# EAGLE design Steuerungsmodul (EAGLE 9.6.2)
BRD_SHEET_NAME: Schaltplan; PROJEKT_NAME: Verstärker_Innovativwoche; REVISION: 1.0; SCH_SHEET_NAME: Steuerungsmodul Verstärker; USER_NAME: Melcher-Millner/Scheffknecht

## Sheet 1 of 2: Input Switch
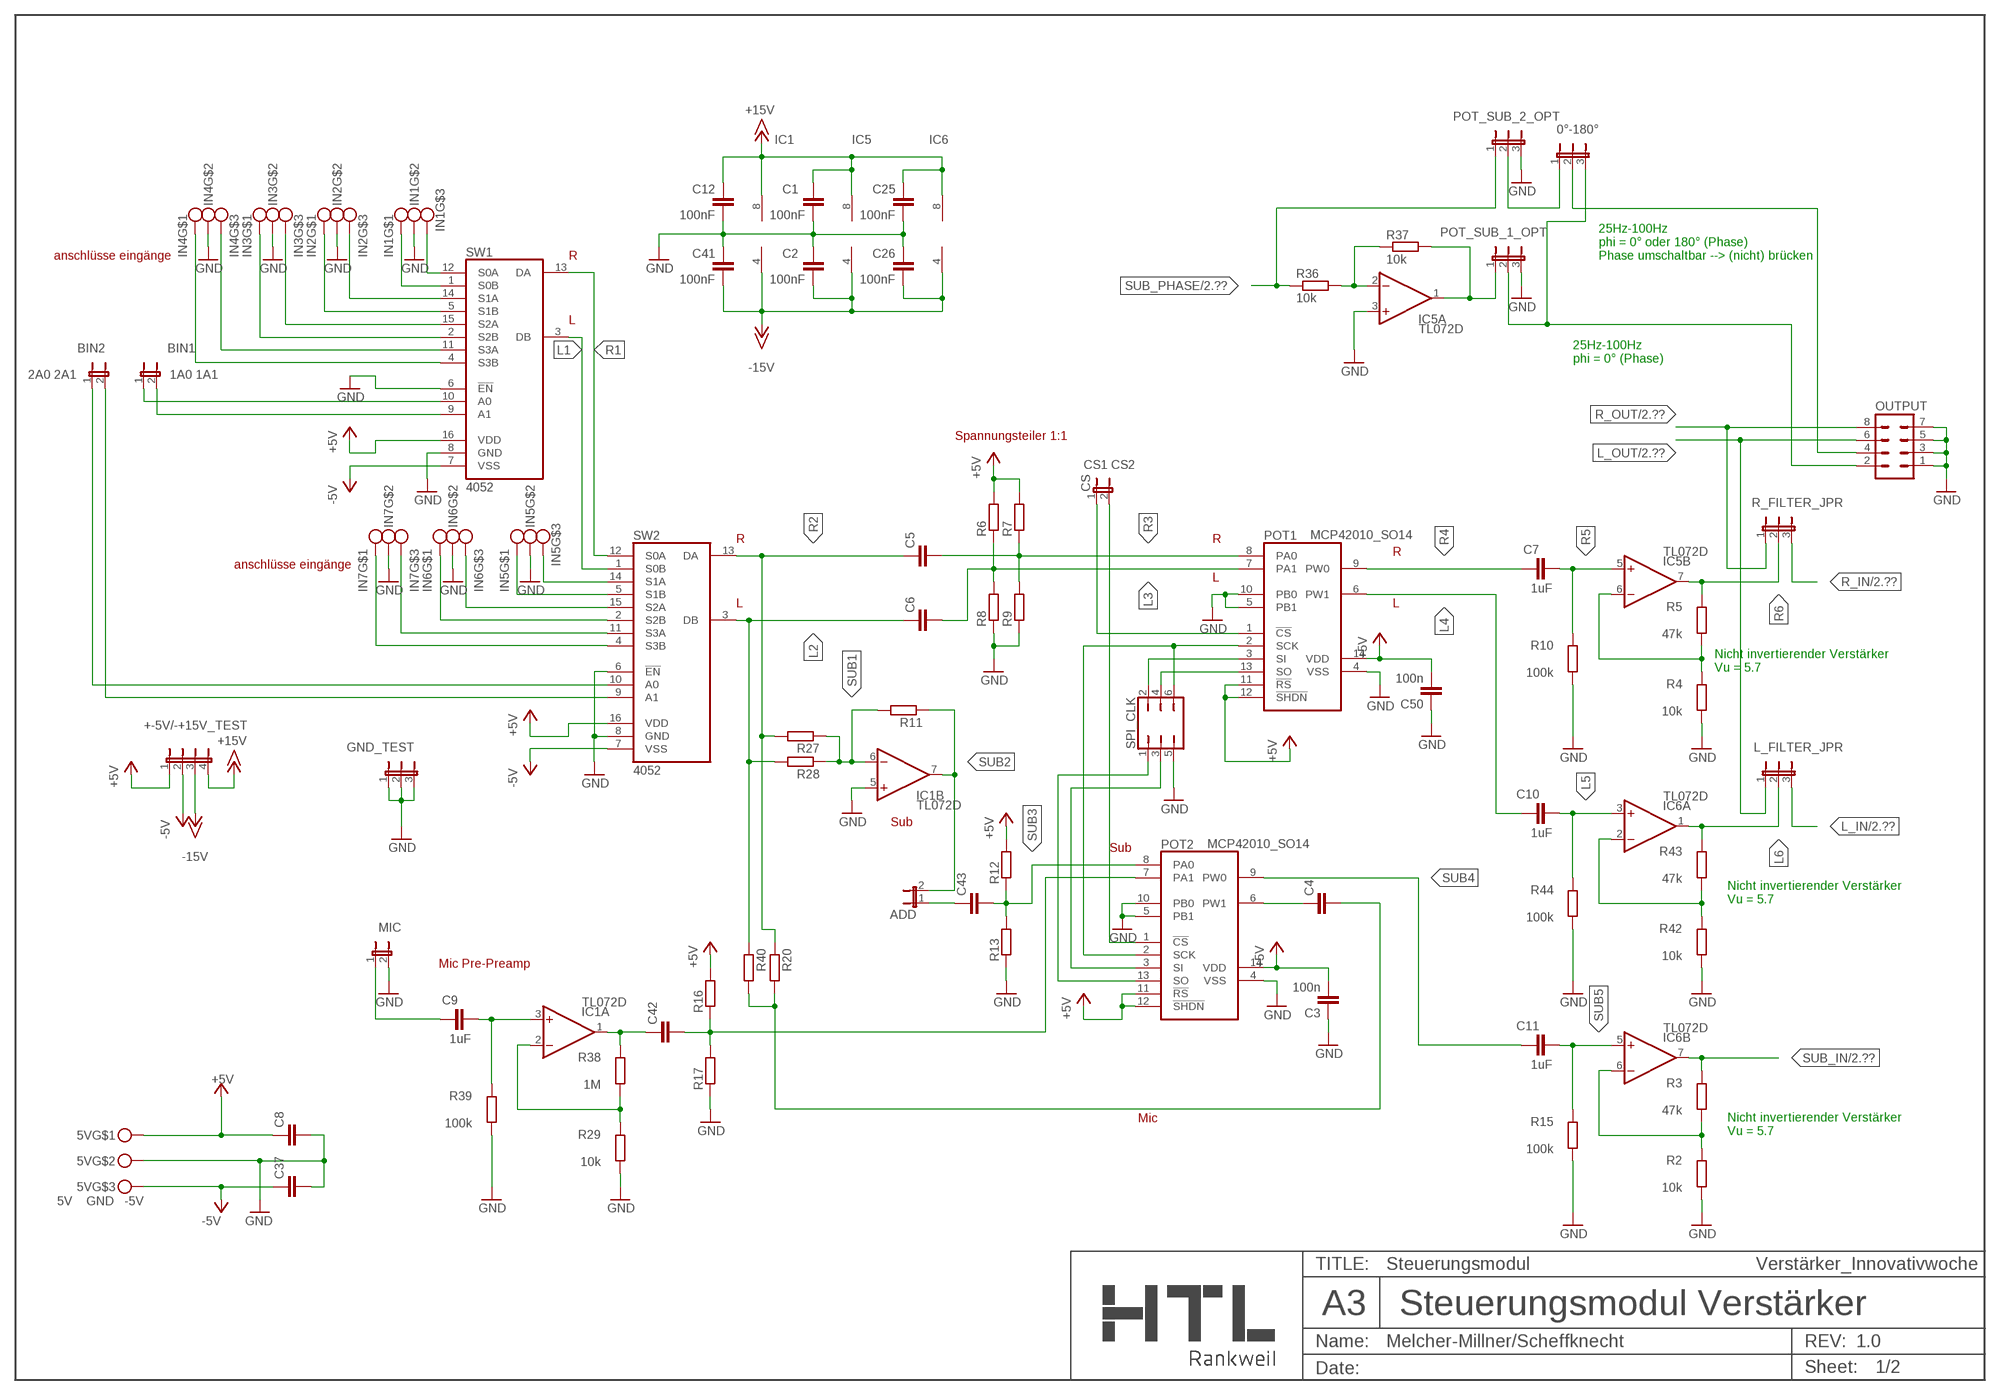
[diagram p0: schematic, sheet 1]

### Parts
0°-180°  JMP3  [JMP3]
5V  5V GND -5V  MKDS3/3_5,08  [MKDS3/3_5,08]
+-5V/-+15V_TEST  JP4E  [JP4]
ADD  JMP2  [JMP2]
BIN1  1A0 1A1  JMP2  [JMP2]
BIN2  2A0 2A1  JMP2  [JMP2]
C1  100nF  C-EUC0805  [C0805]
C2  100nF  C-EUC0805  [C0805]
C3  100n  C-EUC0805  [C0805]
C4  C-EUC0805  [C0805]
C5  C-EUC0805  [C0805]
C6  C-EUC0805  [C0805]
C7  1uF  C-EU025-025X050  [C025-025X050]
C8  C-EUC0805  [C0805]
C9  1uF  C-EU025-025X050  [C025-025X050]
C10  1uF  C-EU025-025X050  [C025-025X050]
C11  1uF  C-EU025-025X050  [C025-025X050]
C12  100nF  C-EUC0805  [C0805]
C25  100nF  C-EUC0805  [C0805]
C26  100nF  C-EUC0805  [C0805]
C37  C-EUC0805  [C0805]
C41  100nF  C-EUC0805  [C0805]
C42  C-EUC0805  [C0805]
C43  C-EUC0805  [C0805]
C50  100n  C-EUC0805  [C0805]
CS  CS1 CS2  JMP2  [JMP2]
FRAME1  HTL-A3-H  [HTL-LEER]
GND_TEST  JMP3  [JMP3]
IC1  TL072D  [SO08]
IC5  TL072D  [SO08]
IC6  TL072D  [SO08]
IN1  MKDS3/3_5,08  [MKDS3/3_5,08]
IN2  MKDS3/3_5,08  [MKDS3/3_5,08]
IN3  MKDS3/3_5,08  [MKDS3/3_5,08]
IN4  MKDS3/3_5,08  [MKDS3/3_5,08]
IN5  MKDS3/3_5,08  [MKDS3/3_5,08]
IN6  MKDS3/3_5,08  [MKDS3/3_5,08]
IN7  MKDS3/3_5,08  [MKDS3/3_5,08]
L_FILTER_JPR  JMP3  [JMP3]
MIC  JMP2  [JMP2]
OUTPUT  MA04-2  [MA04-2]
POT1  MCP42010_SO14  [SO14]
POT2  MCP42010_SO14  [SO14]
POT_SUB_1_OPT  JMP3  [JMP3]
POT_SUB_2_OPT  JMP3  [JMP3]
R2  10k  R-EU_M0805  [M0805]
R3  47k  R-EU_M0805  [M0805]
R4  10k  R-EU_M0805  [M0805]
R5  47k  R-EU_M0805  [M0805]
R6  R-EU_M0805  [M0805]
R7  R-EU_M0805  [M0805]
R8  R-EU_M0805  [M0805]
R9  R-EU_M0805  [M0805]
R10  100k  R-EU_M0805  [M0805]
R11  R-EU_M0805  [M0805]
R12  R-EU_M0805  [M0805]
R13  R-EU_M0805  [M0805]
R15  100k  R-EU_M0805  [M0805]
R16  R-EU_M0805  [M0805]
R17  R-EU_M0805  [M0805]
R20  R-EU_M0805  [M0805]
R27  R-EU_M0805  [M0805]
R28  R-EU_M0805  [M0805]
R29  10k  R-EU_M0805  [M0805]
R36  10k  R-EU_M0805  [M0805]
R37  10k  R-EU_M0805  [M0805]
R38  1M  R-EU_M0805  [M0805]
R39  100k  R-EU_M0805  [M0805]
R40  R-EU_M0805  [M0805]
R42  10k  R-EU_M0805  [M0805]
R43  47k  R-EU_M0805  [M0805]
R44  100k  R-EU_M0805  [M0805]
R_FILTER_JPR  JMP3  [JMP3]
SPI_CLK  JP3Q  [JP3Q]
SW1  4052  5042_SO16_NEU  [SO-16]
SW2  4052  5042_SO16_NEU  [SO-16]

### Nets
1A0: BIN1.1 SW1.10(A0)
1A1: BIN1.2 SW1.9(A1)
2A0: BIN2.1 SW2.10(A0)
2A1: BIN2.2 SW2.9(A1)
+5V: 5V.P$1 +-5V/-+15V_TEST.1 C3.2 C8.1 C50.2 POT1.11(!RS) POT1.12(!SHDN) POT1.14(VDD) POT2.11(!RS) POT2.12(!SHDN) POT2.14(VDD) R6.2 R7.2 R12.2 R16.2 SW1.16(VDD) SW2.16(VDD)
+15V: +-5V/-+15V_TEST.4 C1.1 C12.1 C25.1 IC1.8(P:V+) IC5.8(P:V+) IC6.8(P:V+) ; also sheet 2
-5V: 5V.P$3 +-5V/-+15V_TEST.2 C37.1 SW1.7(VSS) SW2.7(VSS)
-15V: +-5V/-+15V_TEST.3 C2.2 C26.2 C41.2 IC1.4(P:V-) IC5.4(P:V-) IC6.4(P:V-) ; also sheet 2
GND: 5V.P$2 C1.2 C2.1 C3.1 C8.2 C12.2 C25.2 C26.1 C37.2 C41.1 C50.1 GND_TEST.1 GND_TEST.2 GND_TEST.3 IC1.5(B:+IN) IC5.3(A:+IN) IN1.P$2 IN2.P$2 IN3.P$2 IN4.P$2 IN5.P$2 IN6.P$2 IN7.P$2 MIC.2 OUTPUT.1 OUTPUT.3 OUTPUT.5 OUTPUT.7 POT1.4(VSS) POT1.5(PB1) POT1.10(PB0) POT2.4(VSS) POT2.5(PB1) POT2.10(PB0) POT_SUB_1_OPT.3 POT_SUB_2_OPT.3 R2.1 R4.1 R8.1 R9.1 R10.1 R13.1 R15.1 R17.1 R29.1 R39.1 R42.1 R44.1 SPI_CLK.5 SW1.6(!EN) SW1.8(GND) SW2.6(!EN) SW2.8(GND) ; also sheet 2
L1: SW1.3(DB) SW2.1(S0B)
L2: C6.1 R28.2 R40.1 SW2.3(DB)
L3: C6.2 POT1.7(PA1) R6.1 R8.2
L4: C10.1 POT1.6(PW1)
L5: C10.2 IC6.3(A:+IN) R44.2
L6: IC6.1(A:OUT) L_FILTER_JPR.2 R43.2
L_IN: L_FILTER_JPR.3 ; also sheet 2
L_OUT: L_FILTER_JPR.1 OUTPUT.6 ; also sheet 2
N$1: CS.2 POT2.1(!CS)
N$2: CS.1 POT1.1(!CS)
N$3: IC5.1(A:OUT) POT_SUB_1_OPT.1 R37.2
N$10: POT1.3(SI) SPI_CLK.2
N$17: IC6.2(A:-IN) R42.2 R43.1
N$24: IC6.6(B:-IN) R2.2 R3.1
N$26: POT2.13(SO) SPI_CLK.1
N$28: IC5.6(B:-IN) R4.2 R5.1
N$30: C9.1 MIC.1
N$31: POT1.13(SO) SPI_CLK.4
N$32: POT2.3(SI) SPI_CLK.3
N$34: C4.1 POT2.6(PW1)
N$36: C42.2 POT2.7(PA1) R16.1 R17.2
N$37: POT1.2(SCK) POT2.2(SCK) SPI_CLK.6
N$38: IN1.P$3 SW1.12(S0A)
N$39: IN1.P$1 SW1.1(S0B)
N$40: IN2.P$3 SW1.14(S1A)
N$41: IN2.P$1 SW1.5(S1B)
N$42: IN3.P$3 SW1.15(S2A)
N$43: IN3.P$1 SW1.2(S2B)
N$44: IN4.P$3 SW1.11(S3A)
N$45: IN4.P$1 SW1.4(S3B)
N$46: IN5.P$3 SW2.14(S1A)
N$47: IN5.P$1 SW2.5(S1B)
N$48: IN6.P$3 SW2.15(S2A)
N$49: IN6.P$1 SW2.2(S2B)
N$50: IN7.P$3 SW2.11(S3A)
N$51: IN7.P$1 SW2.4(S3B)
N$53: C9.2 IC1.3(A:+IN) R39.2
N$62: IC1.2(A:-IN) R29.2 R38.1
N$64: ADD.1 C43.1
N$71: C42.1 IC1.1(A:OUT) R38.2
N$72: C4.2 R20.2 R40.2
N$80: IC5.2(A:-IN) R36.2 R37.1
N$81: 0°-180°.1 POT_SUB_2_OPT.2
R1: SW1.13(DA) SW2.12(S0A)
R2: C5.1 R20.1 R27.2 SW2.13(DA)
R3: C5.2 POT1.8(PA0) R7.1 R9.2
R4: C7.1 POT1.9(PW0)
R5: C7.2 IC5.5(B:+IN) R10.2
R6: IC5.7(B:OUT) R5.2 R_FILTER_JPR.2
R_IN: R_FILTER_JPR.3 ; also sheet 2
R_OUT: OUTPUT.8 R_FILTER_JPR.1 ; also sheet 2
SUB1: IC1.6(B:-IN) R11.2 R27.1 R28.1
SUB2: ADD.2 IC1.7(B:OUT) R11.1
SUB3: C43.2 POT2.8(PA0) R12.1 R13.2
SUB4: C11.1 POT2.9(PW0)
SUB5: C11.2 IC6.5(B:+IN) R15.2
SUB_IN: IC6.7(B:OUT) R3.2 ; also sheet 2
SUB_OUT_1: 0°-180°.3 OUTPUT.2 POT_SUB_1_OPT.2
SUB_OUT_2: 0°-180°.2 OUTPUT.4
SUB_PHASE: POT_SUB_2_OPT.1 R36.1 ; also sheet 2

### Notes on the sheet
- IC1 | IC5 | IC6
- anschlüsse eingänge | R
- 25Hz-100Hz
  phi = 0° oder 180° (Phase) 
  Phase umschaltbar --> (nicht) brücken
- L
- 25Hz-100Hz
  phi = 0° (Phase)
- Spannungsteiler 1:1
- R | R
- R
- anschlüsse eingänge
- L
- L | L
- Nicht invertierender Verstärker
  Vu = 5.7
- Sub
- Sub
- Nicht invertierender Verstärker
  Vu = 5.7
- Mic Pre-Preamp
- Mic
- Nicht invertierender Verstärker
  Vu = 5.7

## Sheet 2 of 2: Aktivfilter
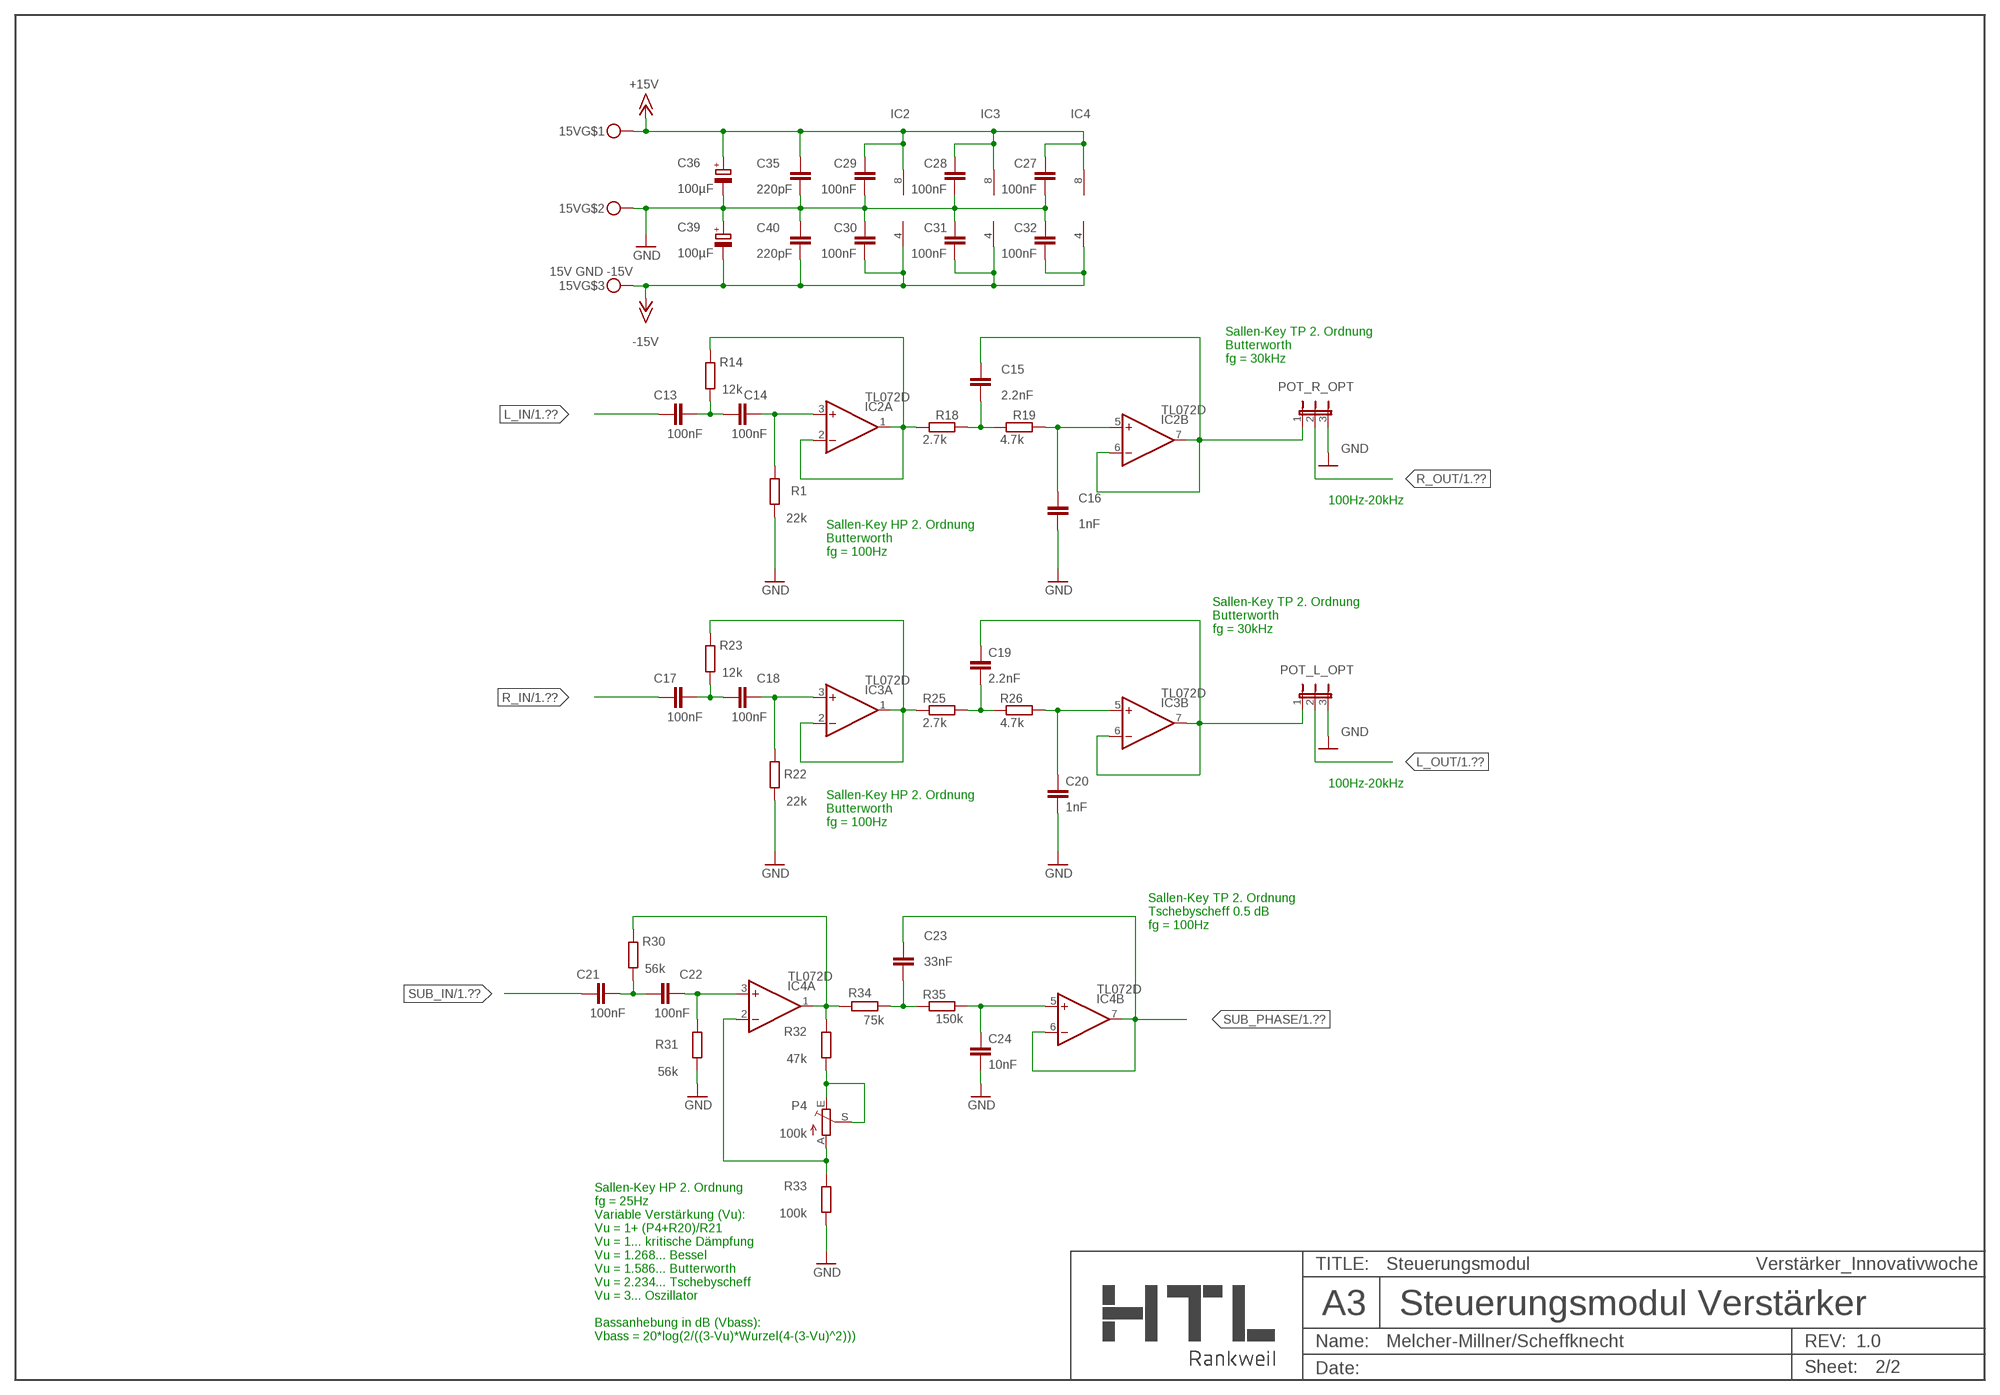
[diagram p1: schematic, sheet 2]

### Parts
15V  15V GND -15V  MKDS3/3_5,08  [MKDS3/3_5,08]
C13  100nF  C-EUC0805  [C0805]
C14  100nF  C-EUC0805  [C0805]
C15  2.2nF  C-EUC0805  [C0805]
C16  1nF  C-EUC0805  [C0805]
C17  100nF  C-EUC0805  [C0805]
C18  100nF  C-EUC0805  [C0805]
C19  2.2nF  C-EUC0805  [C0805]
C20  1nF  C-EUC0805  [C0805]
C21  100nF  C-EUC0805  [C0805]
C22  100nF  C-EUC0805  [C0805]
C23  33nF  C-EUC0805  [C0805]
C24  10nF  C-EUC0805  [C0805]
C27  100nF  C-EUC0805  [C0805]
C28  100nF  C-EUC0805  [C0805]
C29  100nF  C-EUC0805  [C0805]
C30  100nF  C-EUC0805  [C0805]
C31  100nF  C-EUC0805  [C0805]
C32  100nF  C-EUC0805  [C0805]
C35  220pF  C-EUC0805  [C0805]
C36  100µF  CPOL-EUE2.5-6  [E2,5-6]
C39  100µF  CPOL-EUE2.5-6  [E2,5-6]
C40  220pF  C-EUC0805  [C0805]
FRAME2  HTL-A3-H  [HTL-LEER]
IC2  TL072D  [SO08]
IC3  TL072D  [SO08]
IC4  TL072D  [SO08]
P4  100k  TRIM_EU-S64W  [S64W]
POT_L_OPT  JMP3  [JMP3]
POT_R_OPT  JMP3  [JMP3]
R1  22k  R-EU_M0805  [M0805]
R14  12k  R-EU_M0805  [M0805]
R18  2.7k  R-EU_M0805  [M0805]
R19  4.7k  R-EU_M0805  [M0805]
R22  22k  R-EU_M0805  [M0805]
R23  12k  R-EU_M0805  [M0805]
R25  2.7k  R-EU_M0805  [M0805]
R26  4.7k  R-EU_M0805  [M0805]
R30  56k  R-EU_M0805  [M0805]
R31  56k  R-EU_M0805  [M0805]
R32  47k  R-EU_M0805  [M0805]
R33  100k  R-EU_M0805  [M0805]
R34  75k  R-EU_M0805  [M0805]
R35  150k  R-EU_M0805  [M0805]

### Nets
+15V: 15V.P$1 C27.1 C28.1 C29.1 C35.1 C36.+ IC2.8(P:V+) IC3.8(P:V+) IC4.8(P:V+) ; also sheet 1
-15V: 15V.P$3 C30.2 C31.2 C32.2 C39.- C40.2 IC2.4(P:V-) IC3.4(P:V-) IC4.4(P:V-) ; also sheet 1
GND: 15V.P$2 C16.2 C20.2 C24.2 C27.2 C28.2 C29.2 C30.1 C31.1 C32.1 C35.2 C36.- C39.+ C40.1 POT_L_OPT.3 POT_R_OPT.3 R1.1 R22.1 R31.1 R33.1 ; also sheet 1
L_IN: C13.1 ; also sheet 1
L_OUT: POT_L_OPT.2 ; also sheet 1
N$56: IC2.1(A:OUT) IC2.2(A:-IN) R14.2 R18.1
N$57: C14.2 IC2.3(A:+IN) R1.2
N$58: C13.2 C14.1 R14.1
N$59: C15.2 R18.2 R19.1
N$60: C16.1 IC2.5(B:+IN) R19.2
N$61: C15.1 IC2.6(B:-IN) IC2.7(B:OUT) POT_R_OPT.1
N$65: IC3.1(A:OUT) IC3.2(A:-IN) R23.2 R25.1
N$66: C18.2 IC3.3(A:+IN) R22.2
N$67: C17.2 C18.1 R23.1
N$68: C19.2 R25.2 R26.1
N$69: C20.1 IC3.5(B:+IN) R26.2
N$70: C19.1 IC3.6(B:-IN) IC3.7(B:OUT) POT_L_OPT.1
N$73: C21.2 C22.1 R30.1
N$74: C22.2 IC4.3(A:+IN) R31.2
N$75: IC4.1(A:OUT) R30.2 R32.2 R34.2
N$76: IC4.2(A:-IN) P4.A R33.2
N$77: P4.E P4.S R32.1
N$78: C24.1 IC4.5(B:+IN) R35.2
N$79: C23.2 R34.1 R35.1
R_IN: C17.1 ; also sheet 1
R_OUT: POT_R_OPT.2 ; also sheet 1
SUB_IN: C21.1 ; also sheet 1
SUB_PHASE: C23.1 IC4.6(B:-IN) IC4.7(B:OUT) ; also sheet 1

### Notes on the sheet
- IC2 | IC3 | IC4
- Sallen-Key TP 2. Ordnung
  Butterworth
  fg = 30kHz
- 100Hz-20kHz
- Sallen-Key HP 2. Ordnung
  Butterworth
  fg = 100Hz
- Sallen-Key TP 2. Ordnung
  Butterworth
  fg = 30kHz
- 100Hz-20kHz
- Sallen-Key HP 2. Ordnung
  Butterworth
  fg = 100Hz
- Sallen-Key TP 2. Ordnung
  Tschebyscheff 0.5 dB
  fg = 100Hz
- Sallen-Key HP 2. Ordnung
  fg = 25Hz
  Variable Verstärkung (Vu): 
  Vu = 1+ (P4+R20)/R21
  Vu = 1... kritische Dämpfung
  Vu = 1.268... Bessel
  Vu = 1.586... Butterworth
  Vu = 2.234... Tschebyscheff
  Vu = 3... Oszillator
  
  Bassanhebung in dB (Vbass):
  Vbass = 20*log(2/((3-Vu)*Wurzel(4-(3-Vu)^2)))

## Library data of the parts
0°-180° GND_TEST L_FILTER_JPR POT_L_OPT POT_R_OPT POT_SUB_1_OPT POT_SUB_2_OPT R_FILTER_JPR = 0_HTL_elektro:JMP3: Jumper 3-polig
5V 15V IN1-IN7 = 0_HTL_elektro:MKDS3/3_5,08: Leiterplattenklemme 3-polig
+-5V/-+15V_TEST = jumper:JP4E: JUMPER
ADD BIN1 CS MIC = 0_HTL_elektro:JMP2: Jumper 2-polig
BIN2 = 0_HTL_elektro:JMP2: Jumper 2-polig; SPICEPREFIX: B
C1-C6 C8 C12-C32 C35 C37 C40-C43 C50 = rcl:C-EU: CAPACITOR, European symbol
C7 C9-C11 = resistor:C-EU: CAPACITOR, European symbol
C36 C39 = rcl:CPOL-EU: POLARIZED CAPACITOR, European symbol
FRAME1 FRAME2 = 0_HTL_frame:HTL-A3-H: Arbeitsblatt der HTL Rankweil für Schaltpläne DIN-A3 Landscape kombinierbar mit Boardplänen (CHANGE PACKAGE): DIN-A3 Landscape DIN-A3 Portrait DIN-A4 Landscape DIN-A4 Portrait Leer (für Projekte mit mehreren Schaltplänen und einem Board) Über Attribute werden die Beschriftungeinträge gesteuert: Attribut USER_NAME ( Schaltplan + Board) PROJEKT_NAME ( Schaltplan + Board) ACCOUNT_NAME ( Schaltplan + Board) REVISION ( Schaltplan + Board) SCH_SHEET_NAME ( Schaltplan) BRD_SHEET_NAME ( Board)
IC1-IC6 = linear:TL072: OP AMP
OUTPUT = con-lstb:MA04-2: PIN HEADER; OC_FARNELL: unknown; OC_NEWARK: unknown
P4 = pot:TRIM_EU-: POTENTIOMETER
POT1 POT2 = 0_Custom-Lib_Verstärker:MCP42010_SO14
R1-R20 R22 R23 R25-R40 R42-R44 = rcl:R-EU_: RESISTOR, European symbol
SPI_CLK = jumper:JP3Q: JUMPER
SW1 SW2 = 0_Custom-Lib_Verstärker:5042_SO16_NEU

## Board
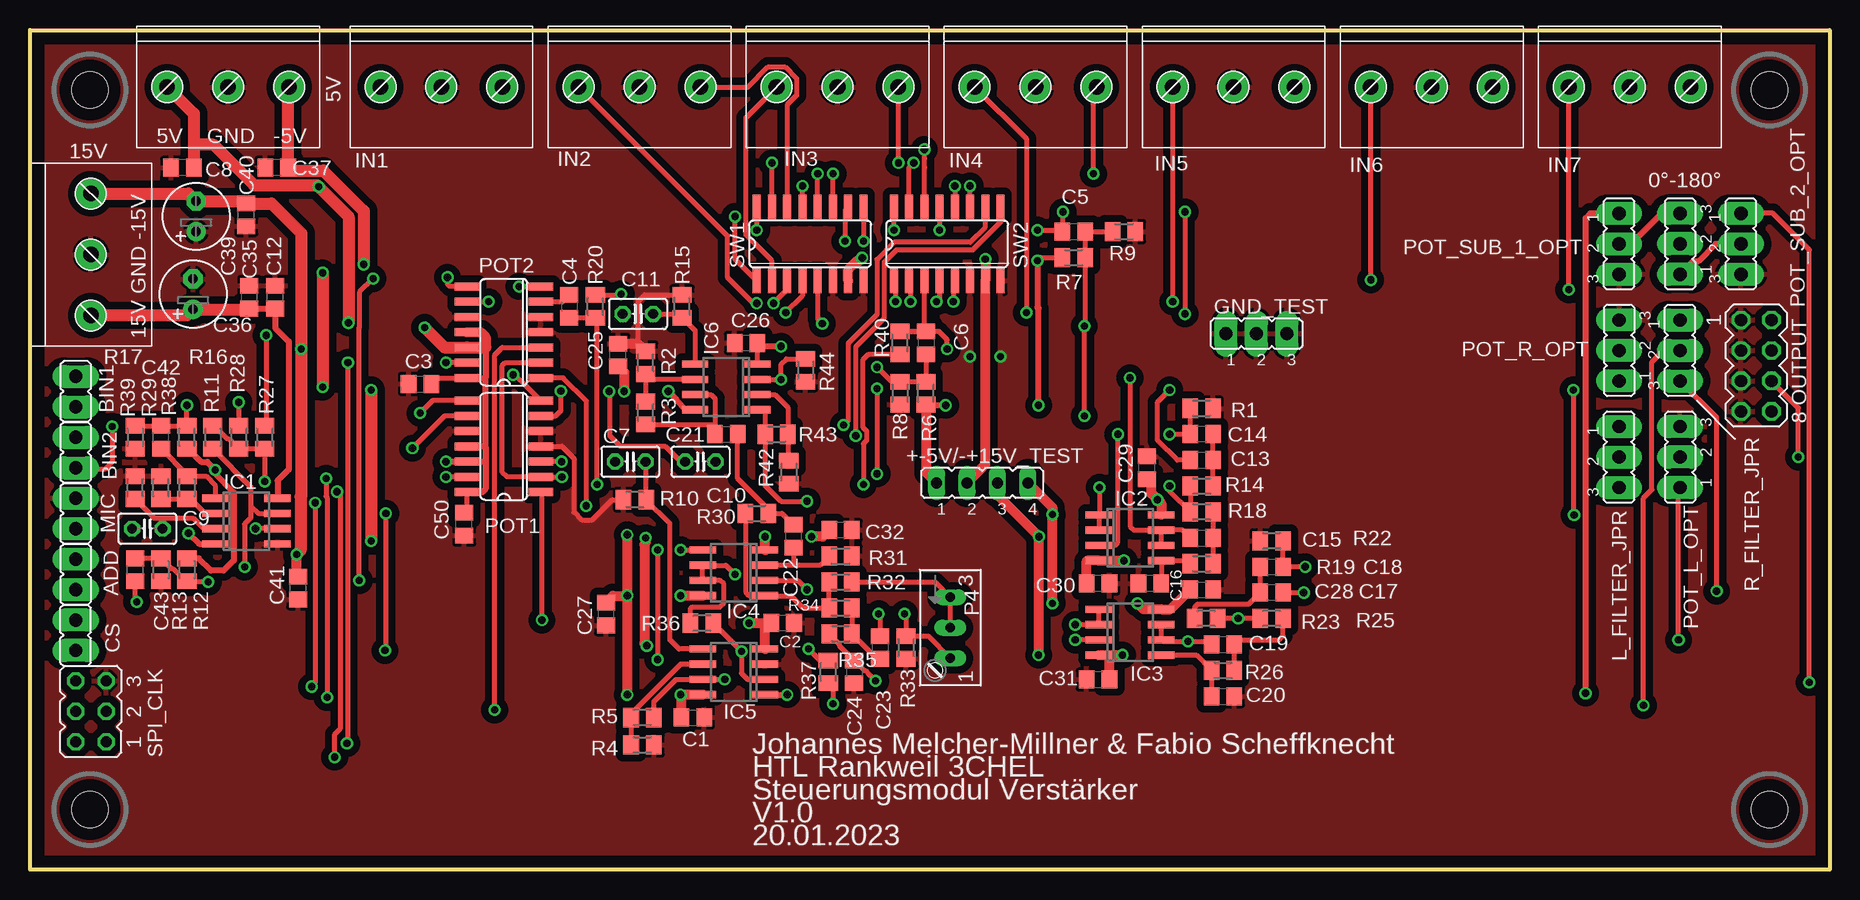
[diagram p2: board, top side]
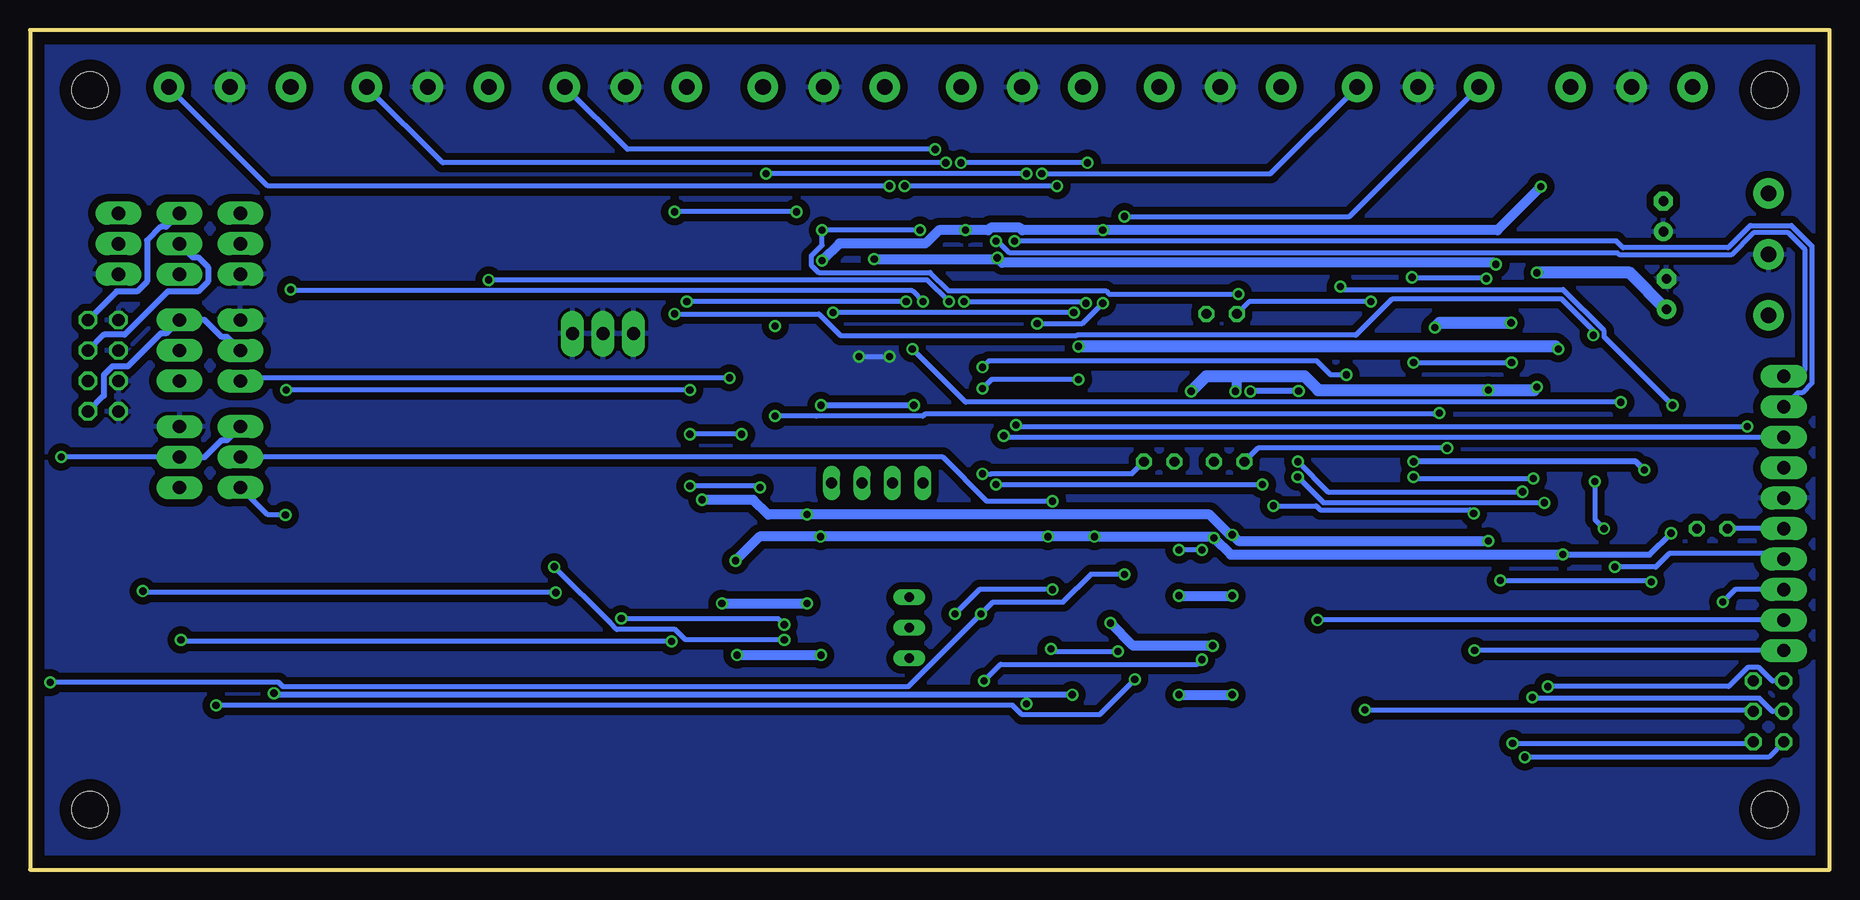
[diagram p3: board, bottom side, seen from below]

Size 150 x 70 mm. Coordinates in mm from the lower left corner, seen from the top.
Outline: 0,0 0,70 150,70 150,0 0,0
Copper layers (1*16): Top 0.035mm / dielectric 1.5mm / Bottom 0.035mm
Design rules "default": minimum track width 10mil, minimum drill 0.6mm, track to track 8mil, track to pad 8mil, pad to pad 8mil, via to via 8mil, smd to smd 8mil, copper to edge 40mil, drill to drill 8mil, minimum pad ring 10mil, minimum via ring 8mil, stop-mask expansion 4mil, vias tented up to drill 0mil, thermal gap 10mil
Holes 3 mm at 5,5 5,65 145,65 145,5

### Footprints (pad centres in the part's own frame; a part is rotated, then mirrored left to right if it is on the bottom)
JMP3 = drill 1.1 pad 1.93 long: 1 -2.54,0; 2 0,0; 3 2.54,0
MKDS3/3_5,08 = drill 1.3 pad 2.54: P$1 -5.08,0; P$2 0,0; P$3 5.08,0
JP4 = drill 0.914 long: 1 -3.81,0; 2 -1.27,0; 3 1.27,0; 4 3.81,0
JMP2 = drill 1.1 pad 1.93 long: 1 0,-1.27; 2 0,1.27
C0805 = smd 1.3 x 1.5: 1 -0.95,0; 2 0.95,0
C025-025X050 = drill 0.813 octagon: 1 -1.27,0; 2 1.27,0
E2,5-6 = drill 0.813 pad 1.6: + -1.27,0 | drill 0.813 pad 1.6 octagon: - 1.27,0
SO08 = smd 0.6 x 2.2: 1 -1.905,-2.6; 2 -0.635,-2.6; 3 0.635,-2.6; 4 1.905,-2.6; 5 1.905,2.6; 6 0.635,2.6; 7 -0.635,2.6; 8 -1.905,2.6
MA04-2 = drill 1.016 octagon: 1 -3.81,-1.27; 2 -3.81,1.27; 3 -1.27,-1.27; 4 -1.27,1.27; 5 1.27,-1.27; 6 1.27,1.27; 7 3.81,-1.27; 8 3.81,1.27
S64W = drill 0.813 long: A 2.54,1.27; E -2.54,1.27; S 0,1.27
SO14 = smd 0.66 x 2.032: 1 -3.81,-3.073; 2 -2.54,-3.073; 3 -1.27,-3.073; 4 0,-3.073; 5 1.27,-3.073; 6 2.54,-3.073; 7 3.81,-3.073; 8 3.81,3.073; 9 2.54,3.073; 10 1.27,3.073; 11 0,3.073; 12 -1.27,3.073; 13 -2.54,3.073; 14 -3.81,3.073
M0805 = smd 1.3 x 1.6: 1 -0.95,0; 2 0.95,0
JP3Q = drill 0.914 octagon: 1 -2.54,-1.27; 2 -2.54,1.27; 3 0,-1.27; 4 0,1.27; 5 2.54,-1.27; 6 2.54,1.27
SO-16 = smd 0.66 x 2.032: 1 -4.445,-3.073; 2 -3.175,-3.073; 3 -1.905,-3.073; 4 -0.635,-3.073; 5 0.635,-3.073; 6 1.905,-3.073; 7 3.175,-3.073; 8 4.445,-3.073; 9 4.445,3.073; 10 3.175,3.073; 11 1.905,3.073; 12 0.635,3.073; 13 -0.635,3.073; 14 -1.905,3.073; 15 -3.175,3.073; 16 -4.445,3.073

### Placement (x,y rotation side)
0°-180°  137.54,52.17 90 top
5V  16.51,65.25 0 top
15V  5.08,51.28 90 top
+-5V/-+15V_TEST  79.38,32.23 0 top
ADD  3.81,24.61 0 top
BIN1  3.81,39.85 0 top
BIN2  3.81,34.77 0 top
C1  55.24,12.67 0 top
C2  62.74,20.55 180 top
C3  32.51,40.48 0 top
C4  44.96,46.96 270 top
C5  87,53.19 0 top
C6  74.68,43.91 270 top
C7  50.04,34.01 0 top
C8  12.7,58.52 180 top
C9  9.78,28.42 0 top
C10  55.88,34.01 0 top
C11  50.67,46.33 0 top
C12  20.45,47.72 90 top
C13  97.66,34.14 0 top
C14  97.66,36.29 180 top
C15  97.66,27.66 0 top
C16  93.34,23.85 180 top
C17  103.5,23.09 180 top
C18  103.5,25.24 0 top
C19  99.44,18.77 0 top
C20  99.44,14.45 0 top
C21  58.04,36.29 0 top
C22  63.63,27.78 270 top
C23  70.87,18.51 270 top
C24  68.71,16.48 270 top
C25  49.02,42.9 90 top
C26  59.69,43.91 0 top
C27  48.01,21.31 270 top
C28  97.66,23.34 0 top
C29  93.09,33.5 90 top
C30  89.03,23.85 180 top
C31  89.03,15.85 0 top
C32  67.56,28.29 180 top
C35  18.29,47.72 90 top
C36  13.59,47.98 90 top
C37  20.57,58.52 180 top
C39  13.84,54.45 90 top
C40  18.03,54.58 90 top
C41  22.35,23.47 90 top
C42  10.92,36.04 90 top
C43  8.76,24.99 90 top
C50  36.2,28.78 90 top
CS  3.81,19.53 180 top
FRAME1  -59.31,-43.84 0 top  (outside the outline)
FRAME2  -59.31,-59.72 0 top  (outside the outline)
GND_TEST  102.23,44.68 0 top
IC1  18.03,29.05 270 top
IC2  91.69,27.66 270 top
IC3  91.69,19.78 270 top
IC4  58.67,24.74 90 top
IC5  58.67,16.48 90 top
IC6  58.04,40.23 90 top
IN1  34.29,65.25 0 top
IN2  50.8,65.25 0 top
IN3  67.31,65.25 0 top
IN4  83.82,65.25 0 top
IN5  100.33,65.25 0 top
IN6  116.84,65.25 0 top
IN7  133.35,65.25 0 top
L_FILTER_JPR  132.46,34.39 270 top
MIC  3.81,29.69 0 top
OUTPUT  143.89,42.01 270 top
P4  75.44,20.16 270 top
POT1  39.5,35.28 90 top
POT2  39.5,44.8 90 top
POT_L_OPT  137.54,34.39 90 top
POT_R_OPT  132.46,43.28 90 top
POT_SUB_1_OPT  132.46,52.17 270 top
POT_SUB_2_OPT  142.62,52.17 270 top
R1  97.66,38.45 180 top
R2  51.31,42.26 270 top
R3  51.31,38.07 270 top
R4  51.05,10.39 180 top
R5  51.05,12.67 0 top
R6  74.68,39.72 270 top
R7  87,51.03 180 top
R8  72.52,39.72 90 top
R9  91.19,53.19 180 top
R10  50.42,30.83 0 top
R11  15.24,36.04 90 top
R12  13.08,24.99 90 top
R13  10.92,24.99 90 top
R14  97.66,31.98 180 top
R15  54.36,46.96 270 top
R16  13.08,36.04 270 top
R17  8.76,36.04 90 top
R18  97.66,29.82 0 top
R19  97.66,25.5 180 top
R20  47.12,46.96 270 top
R22  103.5,27.4 0 top
R23  98.04,20.93 0 top
R25  103.5,20.93 0 top
R26  99.44,16.61 180 top
R27  19.56,36.04 90 top
R28  17.4,36.04 90 top
R29  10.92,31.85 270 top
R30  60.58,29.69 180 top
R31  67.56,26.13 180 top
R32  67.56,23.98 180 top
R33  73.03,18.51 90 top
R34  67.56,21.82 180 top
R35  67.56,19.66 180 top
R36  56.01,20.55 0 top
R37  66.55,16.48 270 top
R38  13.08,31.85 90 top
R39  8.76,31.85 270 top
R40  72.52,43.91 270 top
R42  63.25,33.12 90 top
R43  62.23,36.29 180 top
R44  64.64,41.63 90 top
R_FILTER_JPR  137.54,43.28 270 top
SPI_CLK  5.08,13.18 90 top
SW1  65.02,52.17 0 top
SW2  76.45,52.17 0 top
U$1  [HTL-A4-H]  -58.29,-42.83 0 top  (outside the outline)

### Tracks (layer width: path | path; a pad name or v marks a point on that pad's centre or on a via)
1A0  (via drill 0.6)
  Top 0.406: SW1.10 67.94,54.99 v67.94,52.4
  Bottom 0.406: BIN1.1 2.64,39.75 2.28,39.75 1.47,40.55 1.47,51.99 3.17,53.69 6.6,53.69 8.45,51.85 17.21,51.85 17.76,52.4 v67.94,52.4
1A1  (via drill 0.6)
  Top 0.406: SW1.9 v69.47,52.4
  Bottom 0.406: v69.47,52.4 69.34,52.4 68.34,51.4 17.66,51.4 17.5,51.24 8.19,51.24 6.35,53.08 3.43,53.08 2.08,51.74 2.08,41.63 2.59,41.12 BIN1.2
2A0  (via drill 0.6)
  Top 0.406: v6.86,36.95 6.86,34.01 6.22,33.37 3.94,33.37 BIN2.1 | SW2.10 79.63,53.57 78.36,52.3 72.01,52.3 70.59,50.87 70.59,46.26 68.2,43.87 68.2,37.44 v67.82,37.06
  Bottom 0.406: v67.82,37.06 67.71,36.95 v6.86,36.95
2A1  (via drill 0.6)
  Top 0.406: SW2.9 80.9,53.97 78.61,51.69 72.26,51.69 71.22,50.65 71.22,45.99 68.83,43.6 v68.83,36.17
  Bottom 0.406: v68.83,36.17 68.71,36.04 BIN2.2
+5V  (via drill 0.6)
  Top 0.406: SW1.16 v60.58,53.31 | v72.01,53.31 SW2.16 | v83.97,50.77 84.22,51.03 R7.2 | C3.2 33.97,40.99 POT2.14 | C50.2 36.42,29.96 POT1.14
  Top 0.508: v83.97,50.77 83.97,46.88 84.07,46.78 v84.07,38.71 | v76.33,38.71 74.74,38.71 R6.2 | 37.97,43.53 37.97,40.99 | POT2.14 37.97,40.99 | 37.97,35.28 37.97,40.99 | 37.97,35.28 POT1.11 | 37.97,35.28 37.97,34.01 | 37.97,34.01 POT1.12 v34.67,34.01 | 37.97,34.01 37.97,31.72 37.72,31.47 POT1.14 | R16.2 13.14,35.09 14.25,33.98 14.77,33.98 v15.44,33.32 15.44,33 16.99,31.45 16.99,25.77 16.15,24.92 15.1,24.92 14.07,25.94 R12.2
  Top 0.813: POT2.11 37.59,44.8 37.97,44.42 37.97,43.53 | +-5V/-+15V_TEST.1 74.74,33.05 74.74,38.71
  Top 1.016: v26.54,45.59 26.54,54.45 v24.07,56.93 23.94,57.06 18.68,57.06 15.31,60.42 13.78,60.42 13.65,60.3 | 13.65,60.3 13.65,63.03 5V.P$1 | 13.65,60.3 C8.1 | v32.89,45.18 34.54,43.53 POT2.12 37.97,43.53
  Bottom 0.508: v76.33,38.71 v84.07,38.71 | v15.44,33.32 16.13,34.01 v34.67,34.01
  Bottom 0.813: v24.07,56.93 27.69,53.31 v60.58,53.31 67.28,53.31 67.48,53.52 69.93,53.52 70.13,53.31 v72.01,53.31 74.25,53.31 75.36,52.2 82.54,52.2 v83.97,50.77
  Bottom 1.016: v26.54,45.59 32.49,45.59 v32.89,45.18
+15V  (via drill 0.6)
  Top 0.406: IC6.8 54.66,38.33
  Top 0.508: C35.1 C12.1 20.45,45.14 21.57,44.03 21.57,33.35 20.63,32.42 IC1.8 | v53.21,39.88 53.88,39.2 53.88,39.11 54.66,38.33
  Top 0.813: IC5.8 v54.23,14.58 54.3,14.51 C1.1 | v49.78,27.91 v49.78,22.83 | v49.78,22.83 v49.78,14.58 | IC4.8 v54.23,22.83 | IC2.8 94.29,30.52 v93.98,30.83 93.47,31.34 93.47,32.17 C29.1 | v92.33,22.2 92.84,21.69 IC3.8 95.06,21.69 C28.1 | v85.22,22.2 v85.22,29.59 85.22,30.2 +-5V/-+15V_TEST.4 | C27.1 48.58,22.83 v49.78,22.83 | C25.1 49.53,41.44 v49.53,39.87
  Top 1.016: 15V.P$1 13.08,46.2 C36.+ 18.22,46.71 C35.1 | v24.38,49.76 v24.38,40.23 | v28.45,39.98 v28.45,27.4
  Bottom 0.813: v54.23,14.58 v49.78,14.58 | v28.45,27.4 49.28,27.4 v49.78,27.91 49.99,27.91 51.67,29.59 v85.22,29.59 88.47,29.59 89.71,30.83 v93.98,30.83 | v54.23,22.83 v49.78,22.83 | v92.33,22.2 v85.22,22.2 | v49.53,39.87 49.4,40 49.4,41.12
  Bottom 1.016: C36.+ 16.64,49.76 v24.38,49.76 | v24.38,40.23 24.64,39.98 v28.45,39.98 42.61,39.98 43.75,41.12 49.4,41.12 51.96,41.12 v53.21,39.88
-5V  (via drill 0.6)
  Top 0.813: +-5V/-+15V_TEST.2 79.32,33.45 79.32,33.49 79.63,33.79 SW2.7 v79.63,50.9 | SW1.7 68.2,50.03 68.89,50.72 69.09,50.72 v69.37,51
  Top 1.016: 5V.P$3 21.52,65.18 C37.1 21.77,58.28 24.45,58.28 27.81,54.91 v27.81,50.46
  Bottom 0.813: v79.63,50.9 69.47,50.9 v69.37,51 68.96,50.59 27.94,50.59 v27.81,50.46
-15V  (via drill 0.6)
  Top 0.406: IC6.4 C26.2
  Top 0.508: v62.61,43.62 60.93,43.62 C26.2 | v13.21,28.04 14.1,27.15 IC1.4
  Top 0.813: IC4.4 v61.27,27.76 | v51.31,27.66 51.31,27.2 51.21,27.1 51.21,18.87 v51.41,18.66 | v59.94,20.55 61.21,20.55 | 61.21,20.55 C2.2 | IC5.4 61.27,20.49 61.21,20.55 | IC3.4 89.92,17.88 | 89.92,17.88 v91.06,17.88 | v84.07,17.88 84.07,27.73 v84.1,27.76 80.64,31.22 +-5V/-+15V_TEST.3 | C30.2 88.08,25.69 88.14,25.75 IC2.4 v91.19,25.75 | C32.2 66.08,27.76 v65.15,27.76 | C41.2 22.23,24.54 v22.23,26.26 | C31.2 89.98,17.82 89.92,17.88
  Top 1.016: 15V.P$3 13.21,56.36 C39.- 17.84,55.72 C40.2 20.13,55.53 22.61,53.06 v22.61,43.41 22.61,31.13 22.55,31.08 22.55,26.59 v22.23,26.26
  Bottom 0.508: v22.23,26.26 14.99,26.26 v13.21,28.04
  Bottom 0.813: v22.23,26.26 49.91,26.26 v51.31,27.66 51.41,27.76 v61.27,27.76 v65.15,27.76 v84.1,27.76 89.18,27.76 v91.19,25.75 | v51.41,18.66 58.06,18.66 v59.94,20.55 | v91.06,17.88 v84.07,17.88
  Bottom 1.016: v22.61,43.41 22.62,43.41 22.84,43.62 v62.61,43.62
GND  (via drill 0.6)
  Top 0.406: 50.67,43.85 50.67,47.34 51.24,47.91 R15.1 | POT1.4 44.34,35.28 45.34,34.28 45.34,29.8 45.98,29.16 46.86,29.16 48.53,30.83 R10.1
  Top 0.813: C25.2 50.67,43.85 R2.1
  Bottom 0.406: v80.9,42.77 v78.36,42.77
  pour Top (isolate 0.61): 0,0 150,0 150,70 0,70
  pour Bottom (isolate 0.61): 0,0 0,70 150,70 150,0
L1  (via drill 0.6)
  Top 0.406: SW2.1 72.14,48.97 v72.14,47.34 | SW1.3 63.12,48.36 v61.98,47.22
  Bottom 0.406: v72.14,47.34 62.1,47.34 v61.98,47.22
L2  (via drill 0.6)
  Top 0.406: v17.4,38.96 R28.2 | v76.45,43.41 76.45,44.17 75.76,44.86 R40.1 C6.1 74.55,44.99 SW2.3
  Bottom 0.406: v76.45,43.41 72.01,38.96 v17.4,38.96
L3  (via drill 0.6)
  Top 0.406: C6.2 R6.1 R8.2 71.82,40.67 v70.61,41.88 | POT1.7 41.4,40.26 41.39,40.26 40.4,41.25 v40.28,41.25
  Bottom 0.406: v40.28,41.25 41.57,41.25 42.73,42.42 70.08,42.42 v70.61,41.88
L4  (via drill 0.6)
  Top 0.406: POT1.6 43.81,37.82 44.25,38.25 v44.25,39.91 | v48.26,39.87 48.32,39.81 48.32,36.18 49.2,35.3 52.93,35.3 54.23,34.01 C10.1
  Bottom 0.508: v44.25,39.91 48.23,39.91 v48.26,39.87
L5  (via drill 0.6)
  Top 0.406: IC6.3 v62.61,40.87 62.61,42.14 63.05,42.58 R44.2 | v70.61,40.1 v70.61,32.99
  Bottom 0.406: v62.61,40.87 69.85,40.87 v70.61,40.1 | v70.61,32.99 69.87,32.99 69.85,33.01 58.15,33.01 C10.2
L6  (via drill 0.6)
  Top 0.406: IC6.1 61.27,38.33 61.28,38.32 R43.2 61.28,32.04 62.61,30.71 v64.77,30.71
  Bottom 0.406: v64.77,30.71 70.23,30.71 73.91,34.39 L_FILTER_JPR.2
L_IN  (via drill 0.6)
  Top 0.406: C13.1 95.63,34.14 93.98,35.79 93.98,38.96 v95,39.98 | v128.65,39.98 128.65,29.62 v128.71,29.56
  Bottom 0.406: v95,39.98 v128.65,39.98 | v128.71,29.56 130.18,29.56 L_FILTER_JPR.3
L_OUT  (via drill 0.6)
  Top 0.406: v147.41,34.39 147.41,38.49 OUTPUT.6
  Bottom 0.406: POT_L_OPT.2 v147.41,34.39
  Bottom 0.508: L_FILTER_JPR.1 133.58,35.81 134.01,35.81 135.44,34.39 POT_L_OPT.2
N$1  (via drill 0.6)
  Top 0.406: POT2.1 44.45,40.99 46.35,39.09 v46.35,30.33 | v29.66,29.68 29.66,18.33 v29.59,18.26
  Bottom 0.406: CS.2 v29.59,18.26 | v46.35,30.33 42.79,30.33 42.44,29.98 29.96,29.98 v29.66,29.68
N$2  (via drill 0.6)
  Top 0.406: v42.67,20.8 42.67,31.37 POT1.1
  Bottom 0.406: CS.1 v42.67,20.8
N$3  (via drill 0.6)
  Top 0.406: R37.2 66.93,15.15 v66.93,13.81
  Top 0.508: IC5.1 v63.12,14.58 | v129.67,14.7 129.67,54.33 130.05,54.71 POT_SUB_1_OPT.1
  Bottom 0.406: v66.93,13.81 66.93,14.58
  Bottom 0.508: v63.12,14.58 66.93,14.58 129.54,14.58 v129.67,14.7
N$10  (via drill 0.6)
  Top 0.406: v44.32,34.01 POT1.3 | v25.4,9.37 25.4,11.27 25.84,11.71 25.84,31.24 v25.59,31.5
  Bottom 0.406: v44.32,34.01 41.81,31.5 v25.59,31.5 | SPI_CLK.2 5.08,9.37 v25.4,9.37
N$17
  Top 0.406: IC6.2 62.1,39.6 63.18,38.52 R43.1 63.25,36.23 R42.2
N$24
  Top 0.406: IC6.6 51.76,40.87 R2.2 R3.1
N$26  (via drill 0.6)
  Top 0.406: POT2.13 v34.67,42.26 | v26.5,42.26 26.5,10.59 v26.42,10.51
  Bottom 0.406: v34.67,42.26 v26.5,42.26 | v26.42,10.51 6.48,10.51 SPI_CLK.1
N$28
  Top 0.406: IC5.6 54.23,17.12 50.1,12.99 R5.1 R4.2
N$30
  Bottom 0.406: MIC.1 C9.1
N$31  (via drill 0.6)
  Top 0.406: POT1.13 v34.67,32.74 | v24.77,14.34 24.77,31.04 24.68,31.12 v24.68,32.61
  Bottom 0.406: v34.67,32.74 34.54,32.61 v24.68,32.61 | SPI_CLK.4 4.77,13.18 5.89,14.3 24.72,14.3 v24.77,14.34
N$32  (via drill 0.6)
  Top 0.406: v38.73,13.31 38.73,42.9 39.37,43.53 POT2.3
  Bottom 0.406: v38.73,13.31 6.48,13.31 SPI_CLK.3
N$34
  Top 0.406: C4.1 44.39,47.34 POT2.6
N$36  (via drill 0.6)
  Top 0.406: R17.2 C42.2 R16.1 v13.08,38.71 | v40.77,48.61 POT2.7
  Bottom 0.406: v13.08,38.71 18.77,44.4 18.77,44.93 22.21,48.36 40.51,48.36 v40.77,48.61
N$37  (via drill 0.6)
  Top 0.406: POT2.2 39.62,42.26 39.37,42.01 39.37,33.12 39.75,32.74 POT1.2 v44.32,32.74 v44.33,32.73 | v23.77,30.58 23.77,15.55 v23.47,15.25
  Bottom 0.406: v44.33,32.73 42.19,30.59 v23.78,30.59 v23.77,30.58 | v23.47,15.25 8.4,15.25 6.81,16.84 5.89,16.84 4.77,15.72 SPI_CLK.6
N$38  (via drill 0.6)
  Top 0.406: SW1.12 v65.66,58.01
  Bottom 0.406: v65.66,58.01 46.61,58.01 IN1.P$3
N$39  (via drill 0.6)
  Top 0.406: SW1.1 58.76,50.92 v58.76,54.45
  Bottom 0.406: v58.76,54.45 40.01,54.45 IN1.P$1
N$40
  Top 0.406: SW1.14 63.12,63.77 63.91,64.56 63.91,65.94 62.92,66.93 61.54,66.93 59.86,65.25 IN2.P$3
N$41  (via drill 0.6)
  Top 0.406: IN2.P$1 58.15,52.82 58.15,49.35 60.28,47.22 v60.58,47.22 | SW1.5 65.66,45.91 v66.04,45.52
  Bottom 0.406: v66.04,45.52 62.27,45.52 v60.58,47.22
N$42  (via drill 0.6)
  Top 0.406: SW1.15 v61.85,58.92 | v72.39,58.92 IN3.P$3
  Bottom 0.406: v61.85,58.92 v72.39,58.92
N$43
  Top 0.406: SW1.2 61.85,50.76 59.67,52.94 59.67,62.69 IN3.P$1
N$44  (via drill 0.6)
  Top 0.406: SW1.11 v66.93,58.01 | v88.65,58.01 88.65,65 IN4.P$3
  Bottom 0.406: v66.93,58.01 v88.65,58.01
N$45  (via drill 0.6)
  Top 0.406: IN4.P$1 83.06,60.93 v83.06,46.43 | SW1.4 64.39,47.83 v62.99,46.43
  Bottom 0.406: v62.99,46.43 v83.06,46.43
N$46  (via drill 0.6)
  Top 0.406: SW2.14 74.55,58.52 74.57,58.54 74.57,59.3 74.55,59.32 v74.55,60.04
  Bottom 0.406: v74.55,60.04 100.2,60.04 IN5.P$3
N$47  (via drill 0.6)
  Top 0.406: SW2.5 76.96,48.97 v76.96,47.34 | v95.25,47.34 IN5.P$1
  Bottom 0.406: v76.96,47.34 v95.25,47.34
N$48  (via drill 0.6)
  Top 0.406: SW2.15 73.28,58.52 73.3,58.54 73.3,58.56 v73.66,58.92
  Bottom 0.406: v73.66,58.92 115.59,58.92 IN6.P$3
N$49  (via drill 0.6)
  Top 0.406: SW2.2 73.41,48.97 v73.41,47.34 | v111.76,49.16 IN6.P$1
  Bottom 0.406: v73.41,47.34 75.22,49.16 v111.76,49.16
N$50  (via drill 0.6)
  Top 0.406: SW2.11 v78.36,57
  Bottom 0.406: v78.36,57 130.18,57 IN7.P$3
N$51  (via drill 0.6)
  Top 0.406: SW2.4 75.82,47.6 v75.56,47.34 | v128.27,48.36 IN7.P$1
  Bottom 0.406: v75.56,47.34 75.56,47.36 76.46,48.25 128.16,48.25 v128.27,48.36
N$53
  Top 0.406: IC1.3 14.48,28.42 13.59,29.31 11.05,29.31 | R39.2 10.35,29.31 11.05,29.31 | C9.2 11.05,29.31
N$56  (via drill 0.6)
  Top 0.406: v89.15,31.85 89.15,29.62 IC2.1 IC2.2 | v95,31.98 95,31.53 R18.1 R14.2
  Bottom 0.406: v95,31.98 89.28,31.98 v89.15,31.85
N$57  (via drill 0.6)
  Top 0.406: IC2.3 90.42,27.02 90.68,27.28 v90.68,36.29 | v95,36.29 C14.2 R1.2
  Bottom 0.406: v90.68,36.29 v95,36.29
N$58
  Top 0.406: R14.1 C13.2 C14.1
N$59
  Top 0.406: R18.2 C15.2 R19.1
N$60
  Top 0.406: R19.2 96.46,25.75 IC2.5 C16.1
N$61  (via drill 0.6)
  Top 0.406: IC2.6 IC2.7 | C15.1 96.08,28.29 IC2.7 | v91.69,40.99 91.69,28.61 92.01,28.29 IC2.7
  Bottom 0.406: v91.69,40.99 132.21,40.99 POT_R_OPT.1
N$62
  Top 0.406: IC1.2 14.61,29.69 13.4,30.9 R38.1 R29.2
N$64  (via drill 0.6)
  Top 0.406: v8.89,22.32 8.76,22.45 C43.1
  Bottom 0.406: ADD.1 7.87,23.34 v8.89,22.32
N$65  (via drill 0.6)
  Top 0.406: IC3.1 IC3.2 v87.12,20.42 | R25.1 v100.71,20.93 R23.2
  Bottom 0.406: v100.71,20.93 87.63,20.93 v87.12,20.42
N$66  (via drill 0.6)
  Top 0.406: R22.2 C18.2 v106.3,25.24 | IC3.3 v87.12,19.15
  Bottom 0.406: v106.3,25.24 101.62,20.57 101.62,20.55 101.09,20.02 96.23,20.02 95.36,19.15 v87.12,19.15
N$67
  Top 0.406: C18.1 C17.2 101.6,22.13 97.34,22.13 97.09,21.88 R23.1
N$68
  Top 0.406: R26.1 C19.2 100.77,19.15 104.14,19.15 104.45,19.46 R25.2
N$69
  Top 0.406: IC3.5 97.22,17.88 R26.2 C20.1
N$70  (via drill 0.6)
  Top 0.406: IC3.7 IC3.6 94.42,19.02 v96.52,19.02 98.24,19.02 C19.1 | v137.41,19.15 137.41,31.72 POT_L_OPT.1
  Bottom 0.406: v96.52,19.02 137.29,19.02 v137.41,19.15
N$71
  Top 0.406: C42.1 13.08,32.93 R38.2 14.67,32.8 15.43,32.04 IC1.1
N$72  (via drill 0.6)
  Top 0.406: C4.2 R20.2 47.27,45.86 v47.27,32.1 | v69.47,32.1 69.47,35.52 69.74,35.79 69.74,36.54 69.45,36.84 69.45,42.51 69.9,42.96 R40.2
  Bottom 0.406: v69.47,32.1 v47.27,32.1
N$73
  Top 0.406: C21.2 58.99,32.61 61.53,30.07 R30.1 62.67,29.69 C22.1
N$74
  Top 0.406: R31.2 65.85,25.37 63.63,25.37 | 63.63,25.37 IC4.3 | C22.2 63.63,25.37
N$75
  Top 0.406: R32.2 R34.2 64.45,21.82 63.44,22.83 IC4.1 59.94,22.83 59.69,23.09 59.69,29.63 R30.2
N$76  (via drill 0.6)
  Top 0.406: IC4.2 64.01,24.1 v64.77,23.34 | v72.9,21.31 73.03,21.18 R33.2 74.87,19.46 P4.A
  Bottom 0.406: v64.77,23.34 70.87,23.34 v72.9,21.31
N$77
  Top 0.406: R32.1 75.44,23.98 P4.E P4.S
N$78  (via drill 0.6)
  Top 0.406: v54.23,26.64 IC4.5 | v52.32,26.64 v52.32,17.5 | R35.2 67.46,18.81 67.46,18.69 C24.1 69.55,16.59 69.62,16.59 69.86,16.35 69.86,16.34 v70.48,15.72
  Bottom 0.406: v70.48,15.72 69.09,17.12 52.7,17.12 v52.32,17.5 | v52.32,26.64 v54.23,26.64
N$79
  Top 0.406: R34.1 R35.1 70.61,17.56 C23.2
N$80  (via drill 0.6)
  Top 0.406: R36.2 v59.31,18.19 59.31,16.35 59.82,15.85 IC5.2 | R37.1 65.85,17.43 v64.9,18.39
  Bottom 0.406: v64.9,18.39 64.7,18.19 v59.31,18.19
N$81
  Top 0.508: 0°-180°.1 138.66,50.75 139.09,50.75 140.52,52.17 POT_SUB_2_OPT.2
R1  (via drill 0.6)
  Top 0.406: SW1.13 v64.39,57 | v77.09,57 SW2.12
  Bottom 0.406: v64.39,57 v77.09,57
R2  (via drill 0.6)
  Top 0.406: SW2.13 v75.82,53.31 | v83.97,53.31 85.92,53.31 C5.1 86.11,53.25 v86.11,54.84 | v96.27,54.84 v96.27,46.33 | v19.68,44.55 19.68,37.12 R27.2 | R20.1 49.21,47.91 v49.28,47.98
  Bottom 0.406: v75.82,53.31 v83.97,53.31 83.97,52.06 84.88,51.15 84.88,50.39 84.25,49.77 74.97,49.77 73.45,48.25 60.33,48.25 60.05,47.98 v49.28,47.98 | v86.11,54.84 v96.27,54.84 | v96.27,46.33 84.24,46.33 82.44,44.53 62.76,44.53 62.74,44.55 39.48,44.55 36.43,47.6 22.35,47.6 19.68,44.93 v19.68,44.55
R3  (via drill 0.6)
  Top 0.406: R9.2 C5.2 R7.1 87.94,45.37 v87.88,45.31 v87.88,37.82 | POT1.8 33.55,39.09 v32.51,38.05
  Bottom 0.406: v32.51,38.05 32.86,38.05 32.94,37.97 75.4,37.97 75.57,37.8 84.45,37.8 84.47,37.82 v87.88,37.82
R4  (via drill 0.6)
  Top 0.406: POT1.9 34.56,37.82 v31.88,35.13
  Bottom 0.406: C7.1 47.65,35.13 v31.88,35.13
R5
  Top 0.406: C7.2 51.31,30.89 R10.2 53.32,28.88 53.32,19.17 54.1,18.39 IC5.5
R6  (via drill 0.6)
  Top 0.406: R5.2 52,14 53.85,15.85 IC5.7 v57.91,15.85 | v134.49,13.69 134.49,30.98 135.2,31.69 135.2,42.32 136.16,43.28 R_FILTER_JPR.2
  Bottom 0.406: v134.49,13.69 68.09,13.69 67.31,12.91 60.85,12.91 v57.91,15.85
R_IN  (via drill 0.6)
  Top 0.406: C17.1 v106.17,23.09 | v140.59,23.21 140.59,37.69 R_FILTER_JPR.3
  Bottom 0.406: v106.17,23.09 140.46,23.09 v140.59,23.21
R_OUT
  Bottom 0.508: POT_R_OPT.2 133.58,44.4 134.01,44.4 135.44,45.82 R_FILTER_JPR.1 138.66,44.7 139.09,44.7 141.84,41.96 143.13,41.96 143.84,41.24 143.84,39.52 OUTPUT.8
SUB1  (via drill 0.6)
  Top 0.406: IC1.6 v18.8,28.42 | R11.2 15.37,36.99 16.43,35.93 16.55,35.93 R28.1 R27.1 v19.56,32.36
  Bottom 0.406: v19.56,32.36 19.56,29.18 v18.8,28.42
SUB2  (via drill 0.6)
  Top 0.406: R11.1 18.41,31.91 18.41,30.33 | 18.41,30.33 19.05,29.69 IC1.7 | 18.41,30.33 18.41,29.33 17.89,28.8 v17.89,25.22
  Bottom 0.406: v17.89,25.22 14.48,25.22 13.32,26.39 4.32,26.39 ADD.2
SUB3  (via drill 0.6)
  Top 0.406: v14.86,23.98 14.79,24.04 R12.1 12.95,24.04 11.89,25.1 11.77,25.1 R13.2 C43.2 | POT2.8 35.01,48.61 34.8,48.83 v34.8,49.38 | v27.43,24.1 27.43,24.61 27.41,24.63 27.41,45.16 27.46,45.21 27.46,48.13 v28.59,49.27
  Bottom 0.406: v27.43,24.1 14.99,24.1 v14.86,23.98 | v34.8,49.38 28.7,49.38 v28.59,49.27
SUB4  (via drill 0.6)
  Top 0.406: POT2.9 v38.23,47.34
  Bottom 0.406: v38.23,47.34 48.39,47.34 C11.1
SUB5
  Top 0.406: C11.2 54.04,46.33 R15.2 55.44,44.93 IC6.5
SUB_IN
  Top 0.406: IC6.7 56.77,39.6 57.09,39.28 57.09,37.06 | 57.09,37.06 C21.1 | R3.2 57.02,37.12 57.09,37.06
SUB_OUT_1
  Top 0.508: POT_SUB_1_OPT.2 133.48,52.17 136.02,54.71 0°-180°.3
  Bottom 0.508: 0°-180°.3 138.66,53.59 139.09,53.59 140.23,52.45 140.23,49.04 141.07,48.21 142.77,48.21 OUTPUT.2
SUB_OUT_2
  Bottom 0.508: 0°-180°.2 136.42,51.05 135.99,51.05 135.15,50.22 135.15,49.04 135.99,48.21 138.51,48.21 142.12,44.6 143.84,44.6 OUTPUT.4
SUB_PHASE  (via drill 0.6)
  Top 0.406: v58.78,24.61 58.02,25.37 IC4.6 IC4.7 57.53,24.1 57.83,23.8 57.83,22.24 57.49,21.89 55.19,21.89 55.06,21.76 R36.1 | v148.32,15.59 148.32,51.68 145.29,54.71 POT_SUB_2_OPT.1 | C23.1 70.87,21.18 v70.74,21.31
  Bottom 0.406: v58.78,24.61 61.58,24.61 63.88,22.3 69.74,22.3 v70.74,21.31 76.81,15.24 128.91,15.24 129.29,15.61 148.29,15.61 v148.32,15.59

### Text on the board
tNames: Johannes Melcher-Millner & Fabio Scheffknecht | HTL Rankweil 3CHEL | Steuerungsmodul Verstärker | V1.0 | 20.01.2023